# Altium schematic sheet RAUCH_SCH.SchDoc
size A
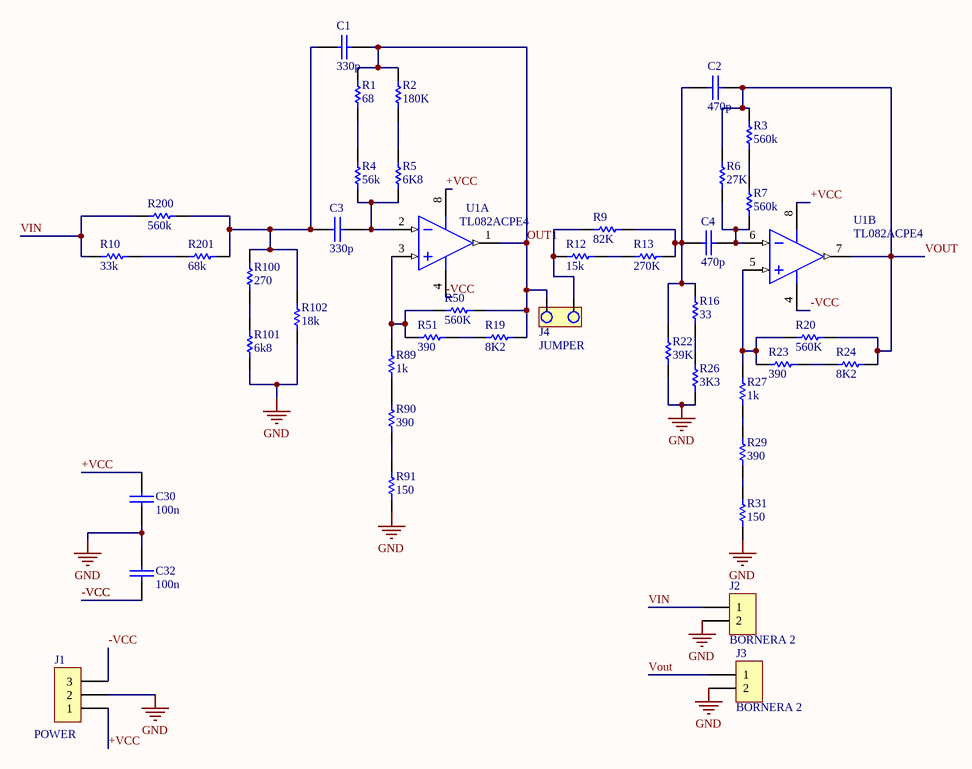
[diagram p0: RAUCH_SCH.SchDoc]

## Parts
C1  330p  [CAP100]
C2  470p  [CAP100]
C3  330p  [CAP100]
C4  470p  [CAP100]
C30  100n  [0805]
C32  100n  [0805]
J1  POWER  [BORNERA3]
J2  BORNERA 2  [BORNERA2]
J3  BORNERA 2  [BORNERA2]
J4  JUMPER  [JUMPER2]
R1  68  [0805]
R2  180K  [0805]
R3  560k  [0805]
R4  56k  [0805]
R5  6K8  [0805]
R6  27K  [0805]
R7  560k  [0805]
R9  82K  [0805]
R10  33k  [0805]
R12  15k  [0805]
R13  270K  [0805]
R16  33  [0805]
R19  8K2  [0805]
R20  560K  [0805]
R22  39K  [0805]
R23  390  [0805]
R24  8K2  [0805]
R26  3K3  [0805]
R27  1k  [0805]
R29  390  [0805]
R31  150  [0805]
R50  560K  [0805]
R51  390  [0805]
R89  1k  [0805]
R90  390  [0805]
R91  150  [0805]
R100  270  [0805]
R101  6k8  [0805]
R102  18k  [0805]
R200  560k  [0805]
R201  68k  [0805]
U1  TL082ACPE4  [TI-P8]  (parts A,B of 2)

## Nets
GND: C30.1 C32.2 J1.2 J2.2 J3.2 R22.2 R26.2 R31.1 R91.1 R101.1 R102.1
+VCC: C30.2 J1.1 U1.8(VCC+)
-VCC: C32.1 J1.3 U1.4(VCC-)
OUT1: C1.2 J4.1 R1.2 R2.2 R19.1 R50.1 U1.1(OUT1)
VIN: J2.1 R10.1 R200.1
VOUT: C2.2 J3.1 R3.1 R6.1 R20.1 R24.1 U1.7(OUT2)
NetC1_1: C1.1 C3.1 R100.2 R102.2 R200.2 R201.2
NetC2_1: C2.1 C4.1 R9.1 R13.1 R16.1 R22.1
NetC3_2: C3.2 R4.1 R5.1 U1.2(IN1-)
NetC4_2: C4.2 R6.2 R7.2 U1.6(IN2-)
NetJ4_2: J4.2 R9.2 R12.2
NetR1_1: R1.1 R4.2
NetR2_1: R2.1 R5.2
NetR3_2: R3.2 R7.1
NetR10_2: R10.2 R201.1
NetR12_1: R12.1 R13.2
NetR16_2: R16.2 R26.1
NetR19_2: R19.2 R51.1
NetR20_2: R20.2 R23.2 R27.2 U1.5(IN2+)
NetR23_1: R23.1 R24.2
NetR27_1: R27.1 R29.2
NetR29_1: R29.1 R31.2
NetR50_2: R50.2 R51.2 R89.2 U1.3(IN1+)
NetR89_1: R89.1 R90.2
NetR90_1: R90.1 R91.2
NetR100_1: R100.1 R101.2

## Library data of the parts
C1-C4 C30 C32 = CAP
J1 = BORNERA 3
R1-R7 R9 R10 R12 R13 R16 R19 R20 R22-R24 R26 R27 R29 R31 R50 R51 R89-R91 R100-R102 R200 R201 = RES
U1 = TL082ACPE4: JFET-Input Operational Amplifier, 7 to 36 V, 0 to 70 degC, 8-pin DIP (P8), Pb-Free (RoHS); Manufacturer: Texas Instruments; CMRR(Min)(dB): 75; GBW(Typ)(MHz): 3; IIB(Max)(pA): 200; Iq per channel(Max)(mA): 2.8; Number of Channels: 2; Offset Drift(Typ)(uV/C): 18; Rating: Catalog; Slew Rate(Typ)(V/us): 13; Sub Family: General Purpose Amplifier, High Supply Voltage Amplifier (>=30V); Total Supply Voltage(Max)(+5V is 5, +/-5V is 10): 36; Total Supply Voltage(Min)(+5V is 5, +/-5V is 10): 7; Vio (25C)(Max)(mV): 6; DatasheetVersion: SLOS081G; PackageVersion: 4040082/E, 04/2010; PackageReference: P8; PackageDescription: 8-Pin Plastic In-Line, Body 9.59 x 6.35 mm, Pitch 2.54 mm; Supplier 1: Digi-Key; Supplier Part Number 1: TL082ACPE4-ND; Supplier 2: Newark; Supplier Part Number 2: 37K4392; Supplier 3: Mouser; Supplier Part Number 3: 595-TL082ACPE4; Eco-Plan: Pb-Free (RoHS); Vn at 1kHz(Typ)(nV/rtHz): 18; Mounting Technology: Through Hole; Code_JEDEC: MS-001; PartNumber: TL082ACPE4; ComponentLink1Description: Manufacturer URL; ComponentLink1URL: http://www.ti.com/; ComponentLink2Description: Datasheet; ComponentLink2URL: http://www.ti.com/lit/ds/symlink/tl082a.pdf; ComponentLink3Description: Package Specification; ComponentLink3URL: http://www.ti.com/litv/pdf/mpdi001b